# Altium project osc_evo.PrjPCB
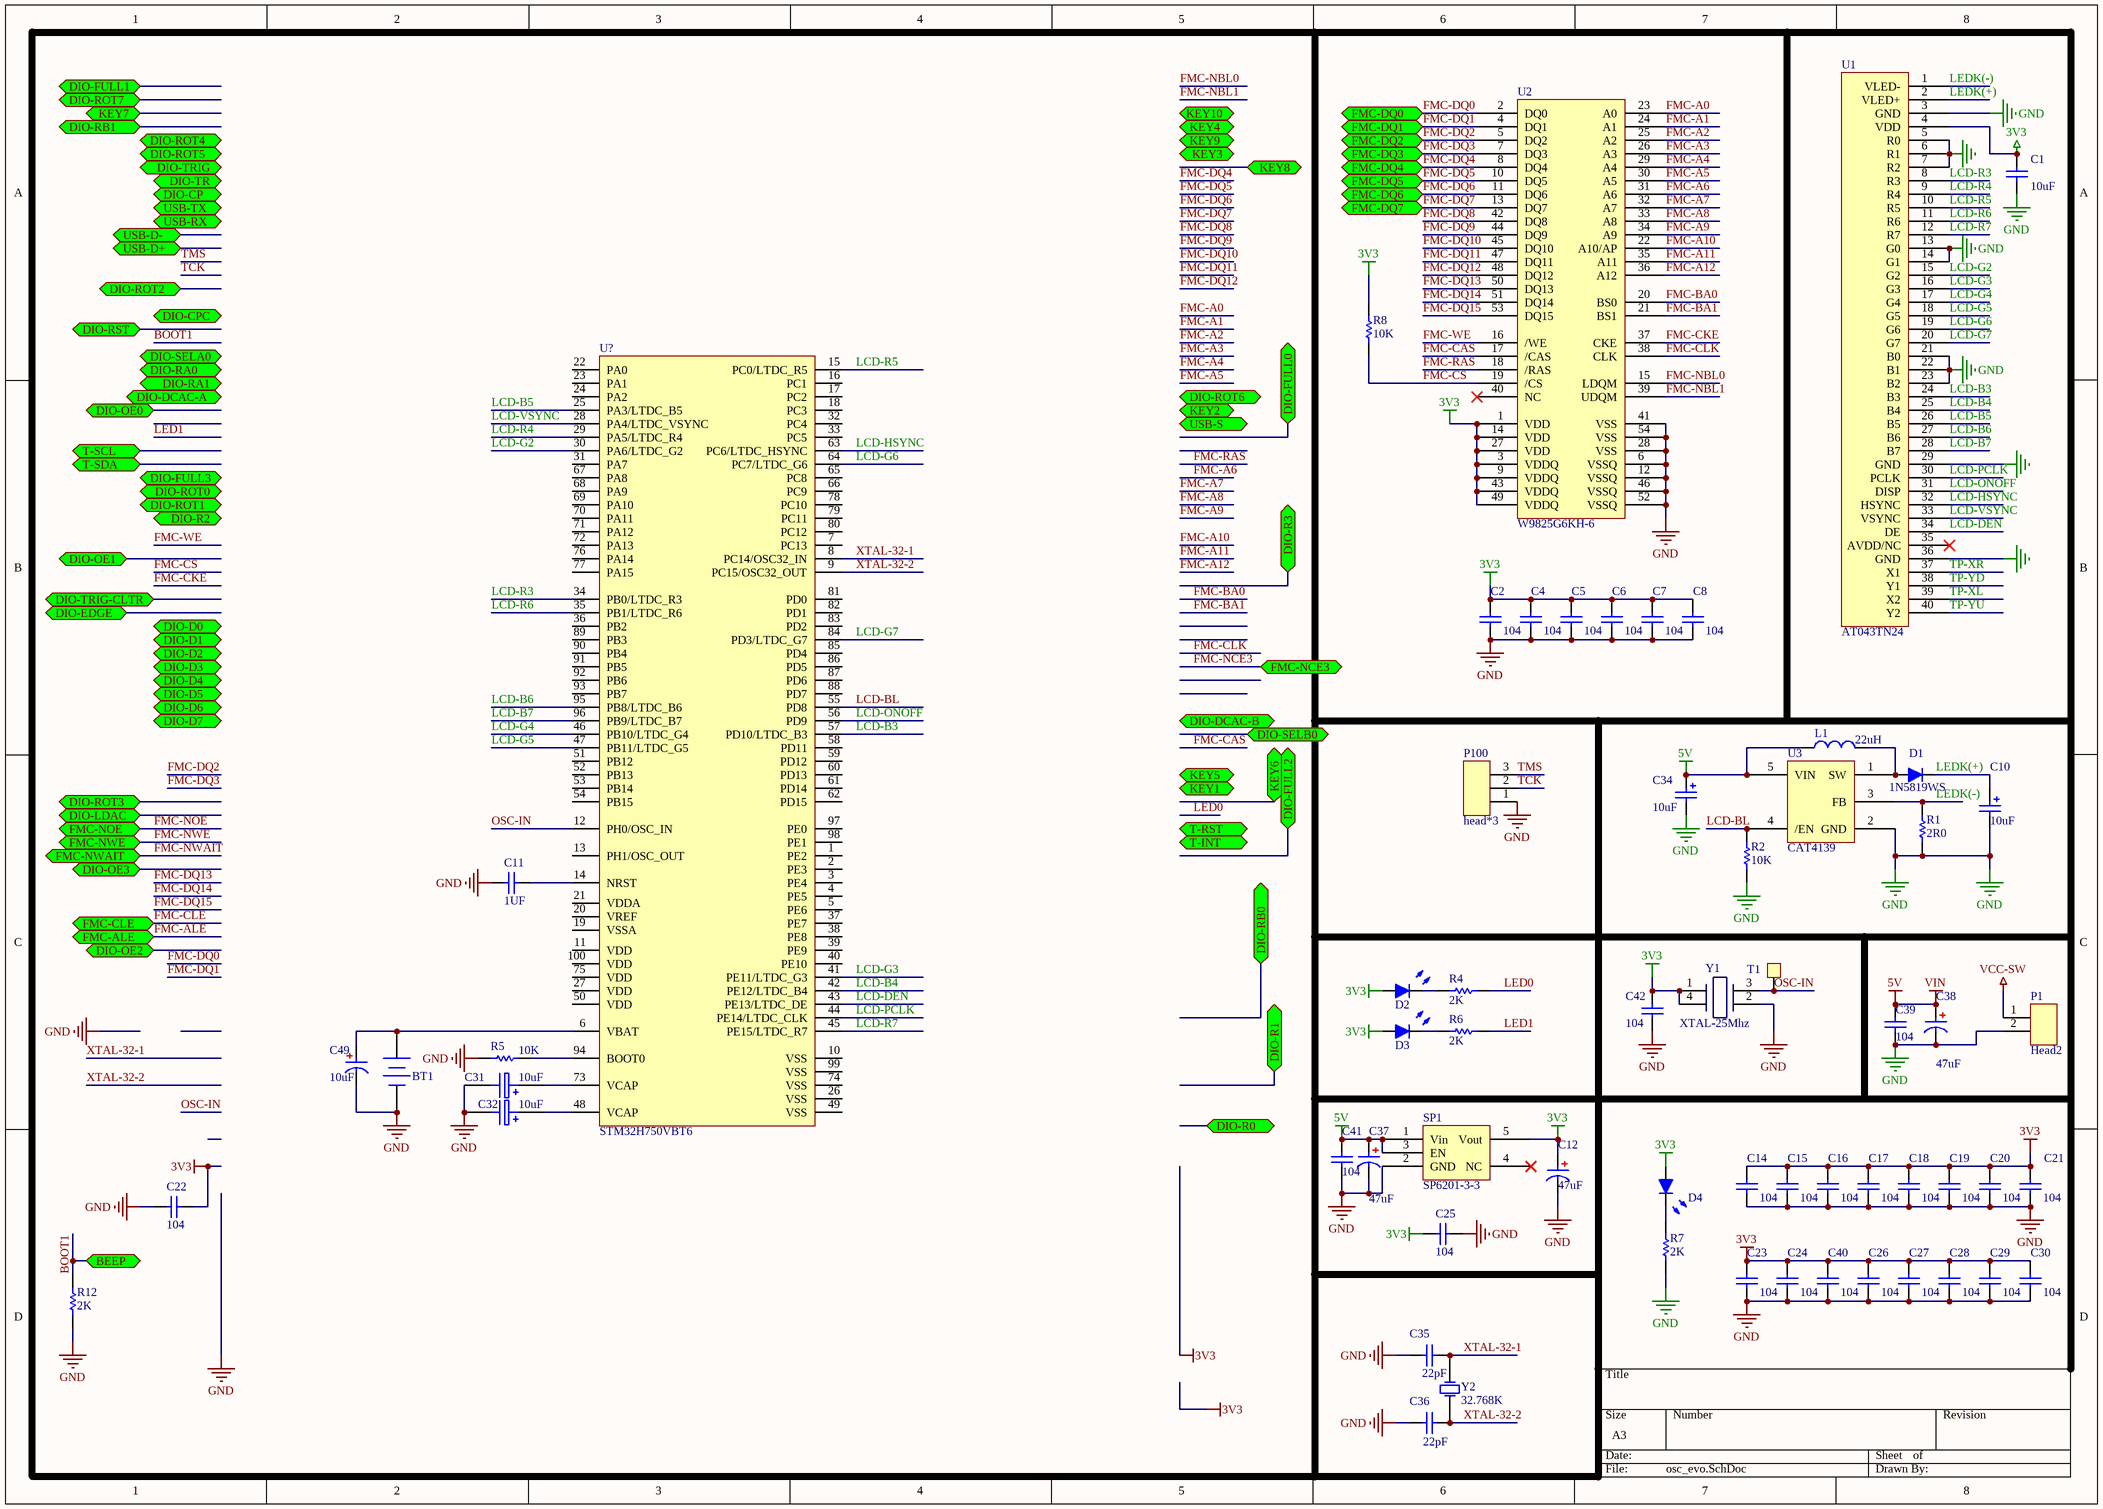
[diagram p0: osc_evo.SchDoc]
2 sheets, 114 parts. Net scope: flat (ports and power ports of the same name join across sheets).
Board file: osc_evo.PcbDoc
Sheets:
  osc_evo.SchDoc
  osc_con.SchDoc

## Sheet osc_evo.SchDoc
size A3

### Parts
BT1  Battery  [BAT1]  (value not drawn)
C1  C10uF  [0603C]  (value not drawn)
C2  C0.1uF  [0402]  (value not drawn)
C4  C0.1uF  [0402]  (value not drawn)
C5  C0.1uF  [0402]  (value not drawn)
C6  C0.1uF  [0402]  (value not drawn)
C7  C0.1uF  [0402]  (value not drawn)
C8  C0.1uF  [0402]  (value not drawn)
C10  value 10uF  [0603C]  (hidden comment: C10uF)
C11  C1UF  [0402]  (value not drawn)
C12  47uF  [CAP-T-3216]
C14  C0.1uF  [0402]  (value not drawn)
C15  C0.1uF  [0402]  (value not drawn)
C16  C0.1uF  [0402]  (value not drawn)
C17  C0.1uF  [0402]  (value not drawn)
C18  C0.1uF  [0402]  (value not drawn)
C19  C0.1uF  [0402]  (value not drawn)
C20  C0.1uF  [0402]  (value not drawn)
C21  C0.1uF  [0402]  (value not drawn)
C22  C0.1uF  [0402]  (value not drawn)
C23  C0.1uF  [0402]  (value not drawn)
C24  C0.1uF  [0402]  (value not drawn)
C25  C0.1uF  [0402]  (value not drawn)
C26  C0.1uF  [0402]  (value not drawn)
C27  C0.1uF  [0402]  (value not drawn)
C28  C0.1uF  [0402]  (value not drawn)
C29  C0.1uF  [0402]  (value not drawn)
C30  C0.1uF  [0402]  (value not drawn)
C31  10uF  [0603C]
C32  10uF  [0603C]
C34  value 10uF  [0603C]  (hidden comment: C10uF)
C35  C22pF  [0402]  (value not drawn)
C36  C22pF  [0402]  (value not drawn)
C37  47uF  [CAP-T-3216]
C38  47uF  [CAP-T-3216]
C39  C0.1uF  [0402]  (value not drawn)
C40  C0.1uF  [0402]  (value not drawn)
C41  C0.1uF  [0402]  (value not drawn)
C42  C0.1uF  [0402]  (value not drawn)
C49  C10uF  [0603C]  (value not drawn)
D1  1N5819WS  [SOD23-322F]
D2  LED-B  [LED]  (value not drawn)
D3  LED-G  [LED]  (value not drawn)
D4  LED  [LED]  (value not drawn)
L1  Inductor-22uH  [ins-443]  (value not drawn)
P1  Head2  [HEAD2]
P100  head*3  [head*3 - duplicate]
R1  R8.2  [0603R]  (value not drawn)
R2  R10K  [0402]  (value not drawn)
R4  R2K  [0402]  (value not drawn)
R5  R10K  [0402]  (value not drawn)
R6  R2K  [0402]  (value not drawn)
R7  R2K  [0402]  (value not drawn)
R8  R10K  [0402]  (value not drawn)
R12  R2K  [0402]  (value not drawn)
SP1  SP6201-3-3  [SOT23-5]
T1  TP  [TEST_POINT]  (value not drawn)
U1  AT043TN24  [FPC40-N]
U2  W9825G6KH-6  [TSOP54]
U3  CAT4139  [SOT23-5]
U?  STM32H750VBT6  [LQFP100]
Y1  XTAL-25Mhz  [XTAL3225]
Y2  Y32.768K-3216  [CRY3215-2P]  (value not drawn)

### Ports
BEEP, DIO-CP, DIO-CPC, DIO-D0, DIO-D1, DIO-D2, DIO-D3, DIO-D4, DIO-D5, DIO-D6, DIO-D7, DIO-DCAC-A, DIO-DCAC-B, DIO-EDGE, DIO-FULL0, DIO-FULL1, DIO-FULL2, DIO-FULL3, DIO-LDAC, DIO-OE0, DIO-OE1, DIO-OE2, DIO-OE3, DIO-R0, DIO-R1, DIO-R2, DIO-R3, DIO-RA0, DIO-RA1, DIO-RB0, DIO-RB1, DIO-ROT0, DIO-ROT1, DIO-ROT2, DIO-ROT3, DIO-ROT4, DIO-ROT5, DIO-ROT6, DIO-ROT7, DIO-RST, DIO-SELA0, DIO-SELB0, DIO-TR, DIO-TRIG, DIO-TRIG-CLTR, FMC-ALE, FMC-CLE, FMC-DQ0, FMC-DQ1, FMC-DQ2, FMC-DQ3, FMC-DQ4, FMC-DQ5, FMC-DQ6, FMC-DQ7, FMC-NCE3, FMC-NOE, FMC-NWAIT, FMC-NWE, KEY1, KEY2, KEY3, KEY4, KEY5, KEY6, KEY7, KEY8, KEY9, KEY10, T-INT, T-RST, T-SCL, T-SDA, USB-D+, USB-D-, USB-RX, USB-S, USB-TX

### Nets
3V3: C1.1 C2.1 C4.1 C5.1 C6.1 C7.1 C8.1 C12.1 C14.1 C15.1 C16.1 C17.1 C18.1 C19.1 C20.1 C21.1 C22.1 C23.1 C24.1 C25.1 C26.1 C27.1 C28.1 C29.1 C30.1 C40.1 C42.2 D2.1(A) D3.1(A) D4.1(A) R8.2 SP1.5(Vout) U1.4(VDD) U2.1(VDD) U2.3(VDDQ) U2.9(VDDQ) U2.14(VDD) U2.27(VDD) U2.43(VDDQ) U2.49(VDDQ) Y1.1 Y1.4
5V: C34.1 C37.1 C38.1 C39.1 C41.2 L1.1 SP1.1(Vin) SP1.3(EN) U3.5(VIN)  [also labelled VIN]
GND: BT1.2(-) C1.2 C2.2 C4.2 C5.2 C6.2 C7.2 C8.2 C10.2 C11.2 C12.2 C14.2 C15.2 C16.2 C17.2 C18.2 C19.2 C20.2 C21.2 C22.2 C23.2 C24.2 C25.2 C26.2 C27.2 C28.2 C29.2 C30.2 C31.2 C32.2 C34.2 C35.1 C36.1 C37.2 C38.2 C39.2 C40.2 C41.1 C42.1 C49.2 P1.2 P100.1 R1.2 R2.1 R5.2 R7.2 R12.1 SP1.2(GND) U1.3(GND) U1.5(R0) U1.6(R1) U1.7(R2) U1.13(G0) U1.14(G1) U1.21(B0) U1.22(B1) U1.23(B2) U1.29(GND) U1.36(GND) U2.6(VSSQ) U2.12(VSSQ) U2.28(VSS) U2.41(VSS) U2.46(VSSQ) U2.52(VSSQ) U2.54(VSS) U3.2(GND) Y1.2
VCC-SW: P1.1
BOOT1: R12.2 ; port BEEP
FMC-A0: U2.23(A0)
FMC-A1: U2.24(A1)
FMC-A2: U2.25(A2)
FMC-A3: U2.26(A3)
FMC-A4: U2.29(A4)
FMC-A5: U2.30(A5)
FMC-A6: U2.31(A6)
FMC-A7: U2.32(A7)
FMC-A8: U2.33(A8)
FMC-A9: U2.34(A9)
FMC-A10: U2.22(A10/AP)
FMC-A11: U2.35(A11)
FMC-A12: U2.36(A12)
FMC-BA0: U2.20(BS0)
FMC-BA1: U2.21(BS1)
FMC-CAS: U2.17(/CAS)
FMC-CKE: U2.37(CKE)
FMC-CLK: U2.38(CLK)
FMC-CS: R8.1 U2.19(/CS)
FMC-DQ0: U2.2(DQ0) ; port FMC-DQ0
FMC-DQ1: U2.4(DQ1) ; port FMC-DQ1
FMC-DQ2: U2.5(DQ2) ; port FMC-DQ2
FMC-DQ3: U2.7(DQ3) ; port FMC-DQ3
FMC-DQ4: U2.8(DQ4) ; port FMC-DQ4
FMC-DQ5: U2.10(DQ5) ; port FMC-DQ5
FMC-DQ6: U2.11(DQ6) ; port FMC-DQ6
FMC-DQ7: U2.13(DQ7) ; port FMC-DQ7
FMC-DQ8: U2.42(DQ8)
FMC-DQ9: U2.44(DQ9)
FMC-DQ10: U2.45(DQ10)
FMC-DQ11: U2.47(DQ11)
FMC-DQ12: U2.48(DQ12)
FMC-DQ13: U2.50(DQ13)
FMC-DQ14: U2.51(DQ14)
FMC-DQ15: U2.53(DQ15)
FMC-NBL0: U2.15(LDQM)
FMC-NBL1: U2.39(UDQM)
FMC-RAS: U2.18(/RAS)
FMC-WE: U2.16(/WE)
LCD-B3: U1.24(B3) U?.57(PD10/LTDC_B3)
LCD-B4: U1.25(B4) U?.42(PE12/LTDC_B4)
LCD-B5: U1.26(B5) U?.25(PA3/LTDC_B5)
LCD-B6: U1.27(B6) U?.95(PB8/LTDC_B6)
LCD-B7: U1.28(B7) U?.96(PB9/LTDC_B7)
LCD-BL: R2.2 U3.4(/EN) U?.55(PD8)
LCD-DEN: U1.34(DE) U?.43(PE13/LTDC_DE)
LCD-G2: U1.15(G2) U?.30(PA6/LTDC_G2)
LCD-G3: U1.16(G3) U?.41(PE11/LTDC_G3)
LCD-G4: U1.17(G4) U?.46(PB10/LTDC_G4)
LCD-G5: U1.18(G5) U?.47(PB11/LTDC_G5)
LCD-G6: U1.19(G6) U?.64(PC7/LTDC_G6)
LCD-G7: U1.20(G7) U?.84(PD3/LTDC_G7)
LCD-HSYNC: U1.32(HSYNC) U?.63(PC6/LTDC_HSYNC)
LCD-ONOFF: U1.31(DISP) U?.56(PD9)
LCD-PCLK: U1.30(PCLK) U?.44(PE14/LTDC_CLK)
LCD-R3: U1.8(R3) U?.34(PB0/LTDC_R3)
LCD-R4: U1.9(R4) U?.29(PA5/LTDC_R4)
LCD-R5: U1.10(R5) U?.15(PC0/LTDC_R5)
LCD-R6: U1.11(R6) U?.35(PB1/LTDC_R6)
LCD-R7: U1.12(R7) U?.45(PE15/LTDC_R7)
LCD-VSYNC: U1.33(VSYNC) U?.28(PA4/LTDC_VSYNC)
LED0: R4.2
LED1: R6.2
LEDK(+): C10.1 D1.2(K) U1.2(VLED+)
LEDK(-): R1.1 U1.1(VLED-) U3.3(FB)
OSC-IN: T1.1(R) U?.12(PH0/OSC_IN) Y1.3
TCK: P100.2
TMS: P100.3
TP-XL: U1.39(X2)
TP-XR: U1.37(X1)
TP-YD: U1.38(Y1)
TP-YU: U1.40(Y2)
XTAL-32-1: C35.2 U?.8(PC14/OSC32_IN) Y2.2(OSC2)
XTAL-32-2: C36.2 U?.9(PC15/OSC32_OUT) Y2.1(OSC1)
NetBT1_1: BT1.1(+) C49.1 U?.6(VBAT)
NetC11_1: C11.1 U?.14(NRST)
NetC31_1: C31.1 U?.73(VCAP)
NetC32_1: C32.1 U?.48(VCAP)
NetD1_1: D1.1(A) L1.2 U3.1(SW)
NetD2_2: D2.2(K) R4.1
NetD3_2: D3.2(K) R6.1
NetD4_2: D4.2(K) R7.1
NetR5_1: R5.1 U?.94(BOOT0)

Not connected (* = marked no-connect by the designer): SP1 4(NC)*; U1 35(AVDD/NC)*; U2 40(NC)*; U? 1(PE2) 2(PE3) 3(PE4) 4(PE5) 5(PE6) 7(PC13) 10(VSS) 11(VDD) 13(PH1/OSC_OUT) 16(PC1) 17(PC2) 18(PC3) 19(VSSA) 20(VREF) 21(VDDA) 22(PA0) 23(PA1) 24(PA2) 26(VSS) 27(VDD) 31(PA7) 32(PC4) 33(PC5) 36(PB2) 37(PE7) 38(PE8) 39(PE9) 40(PE10) 49(VSS) 50(VDD) 51(PB12) 52(PB13) 53(PB14) 54(PB15) 58(PD11) 59(PD12) 60(PD13) 61(PD14) 62(PD15) 65(PC8) 66(PC9) 67(PA8) 68(PA9) 69(PA10) 70(PA11) 71(PA12) 72(PA13) 74(VSS) 75(VDD) 76(PA14) 77(PA15) 78(PC10) 79(PC11) 80(PC12) 81(PD0) 82(PD1) 83(PD2) 85(PD4) 86(PD5) 87(PD6) 88(PD7) 89(PB3) 90(PB4) 91(PB5) 92(PB6) 93(PB7) 97(PE0) 98(PE1) 99(VSS) 100(VDD)

### Notes on the sheet
- (in symbol C0.1uF) 1UF; 104
- (in symbol C10uF) 10uF
- (in symbol C10uF-B) 10uF
- (in symbol C22pF) 22pF
- (in symbol Inductor-100uH) 22uH
- (in symbol R2K) 2K
- (in symbol R8.2) 2R0
- (in symbol R10K) 10K
- (in symbol Y32.768K) 32.768K

### Library data of the parts
BT1 = Battery: Multicell Battery; Published: 24-Mar-1999; Revision: July-2002: Re-released for DXP Platform.; Publisher: Altium Limited
C1 = C10uF-B
C10 C34 = Cap Pol1: Polarized Capacitor (Radial); Published: 8-Jun-2000; Revision: July-2002: Re-released for DXP Platform.; Publisher: Altium Limited
C11 = C0.1uF
C12 C37 C38 = C10uF: 贴片电容
C31 C32 = ELECTRO1: Electrolytic Capacitor
D1 = Diode
D2 D3 = LED
L1 = Inductor-100uH
SP1 = SP6201
Y1 = XTAL-100Mhz
Y2 = Y32.768K

## Sheet osc_con.SchDoc
size A4
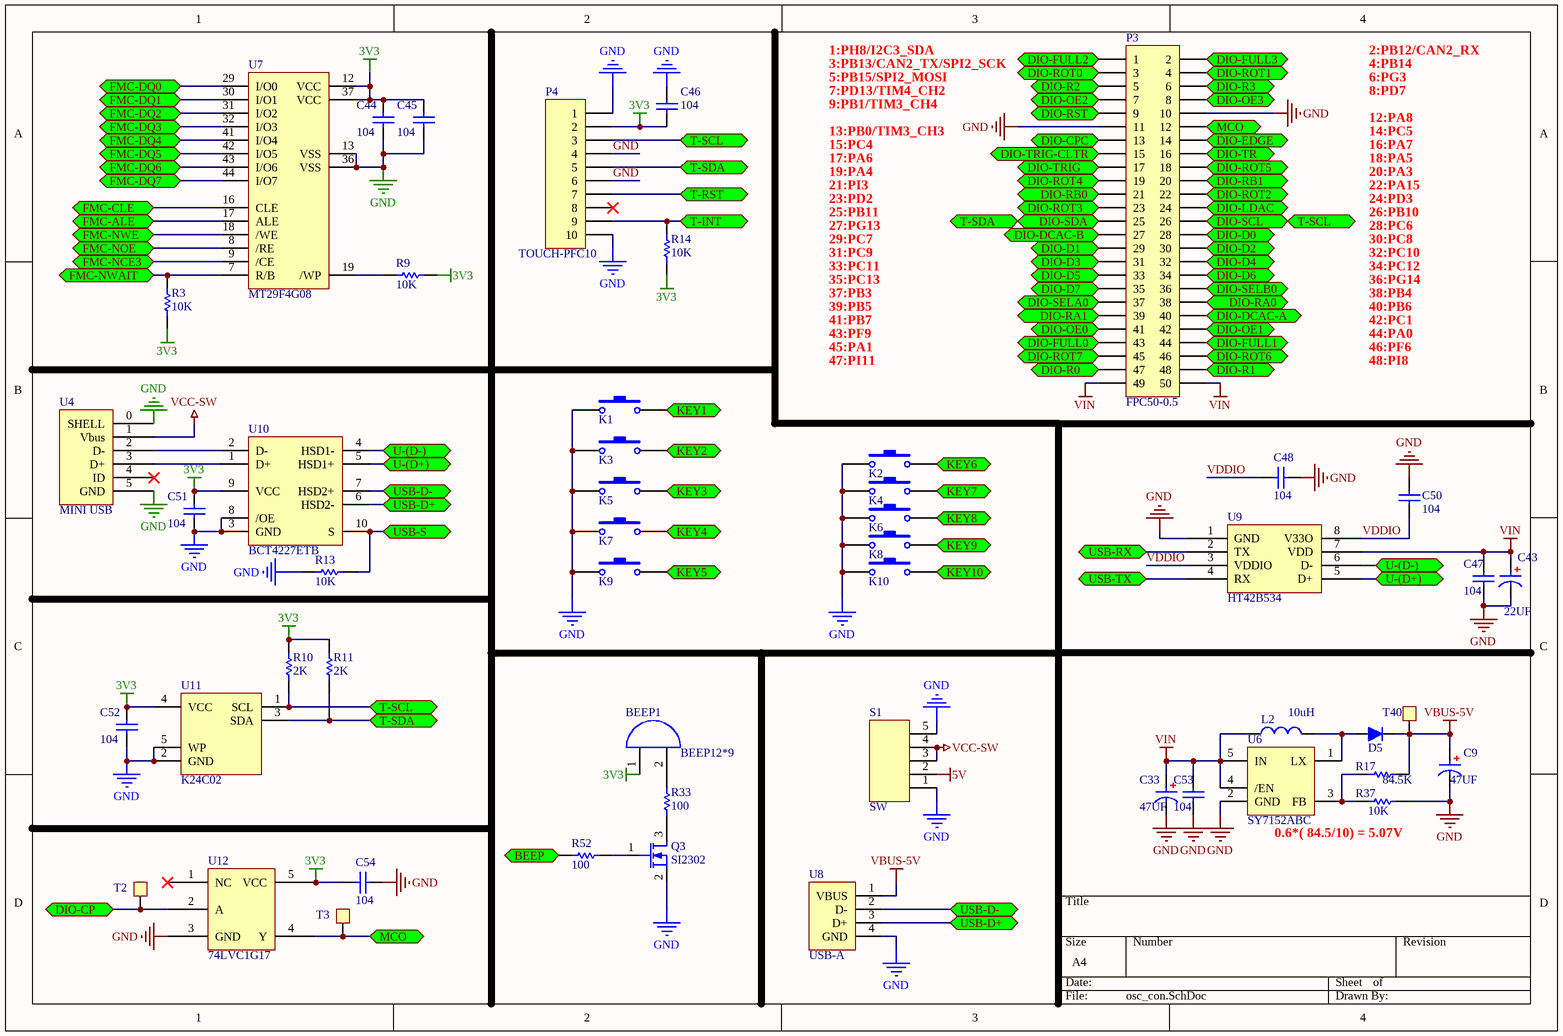
[diagram p1: osc_con.SchDoc]

### Parts
BEEP1  BEEP12*9  [BEEP]
C9  47UF  [CAP-T-3216]
C33  47UF  [CAP-T-3216]
C43  22UF  [0603C]
C44  C0.1uF  [0402]  (value not drawn)
C45  C0.1uF  [0402]  (value not drawn)
C46  C0.1uF  [0402]  (value not drawn)
C47  104  [0402]
C48  104  [0402]
C50  104  [0402]
C51  C0.1uF  [0402]  (value not drawn)
C52  C0.1uF  [0402]  (value not drawn)
C53  104  [0402]
C54  C0.1uF  [0402]  (value not drawn)
D5  1N5918WS  [SOD23-322F]  (value not drawn)
K1  KEY-PB  [KEY_6*6*4.3]  (value not drawn)
K2  KEY-PB  [KEY_6*6*4.3]  (value not drawn)
K3  KEY-PB  [KEY_6*6*4.3]  (value not drawn)
K4  KEY-PB  [KEY_6*6*4.3]  (value not drawn)
K5  KEY-PB  [KEY_6*6*4.3]  (value not drawn)
K6  KEY-PB  [KEY_6*6*4.3]  (value not drawn)
K7  KEY-PB  [KEY_6*6*4.3]  (value not drawn)
K8  KEY-PB  [KEY_6*6*4.3]  (value not drawn)
K9  KEY-PB  [KEY_6*6*4.3]  (value not drawn)
K10  KEY-PB  [KEY_6*6*4.3]  (value not drawn)
L2  10uH  [0805]
P3  FPC50-0.5  [FPC50-0.5]
P4  TOUCH-PFC10  [FPC10-0.5]
Q3  SI2302  [SOT-23-3]
R3  R10K  [0402]  (value not drawn)
R9  R10K  [0402]  (value not drawn)
R10  R2K  [0402]  (value not drawn)
R11  R2K  [0402]  (value not drawn)
R13  R10K  [0402]  (value not drawn)
R14  R10K  [0402]  (value not drawn)
R17  R84.5K  [0402]  (value not drawn)
R33  R100R  [0402]  (value not drawn)
R37  10K  [0402]
R52  R100R  [0402]  (value not drawn)
S1  SW  [SW-3]
T2  TP  [TEST_POINT]  (value not drawn)
T3  TP  [TEST_POINT]  (value not drawn)
T40  TP  [TEST_POINT]  (value not drawn)
U4  MINI USB  [Micro_USB_t]
U6  SY7152ABC  [SOT23-6]
U7  MT29F4G08  [TSOP48]
U8  USB-A  [USB-A-SMA]
U9  HT42B534  [SOP-8]
U10  BCT4227ETB  [WQFN10]
U11  K24C02  [SOT23-5]
U12  74LVC1G17  [SOT23-5]

### Ports
BEEP, DIO-CP, DIO-CPC, DIO-D0, DIO-D1, DIO-D2, DIO-D3, DIO-D4, DIO-D5, DIO-D6, DIO-D7, DIO-DCAC-A, DIO-DCAC-B, DIO-EDGE, DIO-FULL0, DIO-FULL1, DIO-FULL2, DIO-FULL3, DIO-LDAC, DIO-OE0, DIO-OE1, DIO-OE2, DIO-OE3, DIO-R0, DIO-R1, DIO-R2, DIO-R3, DIO-RA0, DIO-RA1, DIO-RB0, DIO-RB1, DIO-ROT0, DIO-ROT1, DIO-ROT2, DIO-ROT3, DIO-ROT4, DIO-ROT5, DIO-ROT6, DIO-ROT7, DIO-RST, DIO-SCL, DIO-SDA, DIO-SELA0, DIO-SELB0, DIO-TR, DIO-TRIG, DIO-TRIG-CLTR, FMC-ALE, FMC-CLE, FMC-DQ0, FMC-DQ1, FMC-DQ2, FMC-DQ3, FMC-DQ4, FMC-DQ5, FMC-DQ6, FMC-DQ7, FMC-NCE3, FMC-NOE, FMC-NWAIT, FMC-NWE, KEY1, KEY2, KEY3, KEY4, KEY5, KEY6, KEY7, KEY8, KEY9, KEY10, MCO, T-INT, T-RST, T-SCL, T-SDA, U-(D+), U-(D-), USB-D+, USB-D-, USB-RX, USB-S, USB-TX

### Nets
3V3: BEEP1.1(A) C44.1 C45.1 C46.2 C51.1 C52.1 C54.1 P4.2 R3.1 R9.2 R10.2 R11.2 R14.1 U7.12(VCC) U7.37(VCC) U10.9(VCC) U11.4(VCC) U12.5(VCC)
5V: C33.1 C43.1 C47.1 C53.1 L2.1 P3.49 P3.50 S1.2 U6.4(/EN) U6.5(IN) U9.7(VDD)  [also labelled VIN]
GND: C9.2 C33.2 C43.2 C44.2 C45.2 C46.1 C47.2 C48.2 C50.2 C51.2 C52.2 C53.2 C54.2 K1.1 K2.1 K3.1 K4.1 K5.1 K6.1 K7.1 K8.1 K9.1 K10.1 P3.10 P3.11 P4.1 P4.4 P4.6 P4.10 Q3.2(S) R13.1 R37.1 S1.1 S1.5 U4.0(SHELL) U4.5(GND) U6.2(GND) U7.13(VSS) U7.36(VSS) U8.4(GND) U9.1(GND) U10.3(GND) U10.8(/OE) U11.2(GND) U11.5(WP) U12.3(GND)
VBUS-5V: C9.1 D5.2(K) R17.2 T40.1(R) U8.1(VBUS)
VCC-SW: S1.3 S1.4 U4.1(Vbus)
BOOT1: R52.1 ; port BEEP
FMC-ALE: U7.17(ALE) ; port FMC-ALE
FMC-CLE: U7.16(CLE) ; port FMC-CLE
FMC-DQ0: U7.29(I/O0) ; port FMC-DQ0
FMC-DQ1: U7.30(I/O1) ; port FMC-DQ1
FMC-DQ2: U7.31(I/O2) ; port FMC-DQ2
FMC-DQ3: U7.32(I/O3) ; port FMC-DQ3
FMC-DQ4: U7.41(I/O4) ; port FMC-DQ4
FMC-DQ5: U7.42(I/O5) ; port FMC-DQ5
FMC-DQ6: U7.43(I/O6) ; port FMC-DQ6
FMC-DQ7: U7.44(I/O7) ; port FMC-DQ7
FMC-NCE3: U7.9(/CE) ; port FMC-NCE3
FMC-NOE: U7.8(/RE) ; port FMC-NOE
FMC-NWAIT: R3.2 U7.7(R/B) ; port FMC-NWAIT
FMC-NWE: U7.18(/WE) ; port FMC-NWE
VDDIO: C48.1 C50.1 U9.3(VDDIO) U9.8(V33O)
NetBEEP1_2: BEEP1.2(B) R33.2
NetD5_1: D5.1(A) L2.2 U6.1(LX)
NetK1_2: K1.2 ; port KEY1
NetK2_2: K2.2 ; port KEY6
NetK3_2: K3.2 ; port KEY2
NetK4_2: K4.2 ; port KEY7
NetK5_2: K5.2 ; port KEY3
NetK6_2: K6.2 ; port KEY8
NetK7_2: K7.2 ; port KEY4
NetK8_2: K8.2 ; port KEY9
NetK9_2: K9.2 ; port KEY5
NetK10_2: K10.2 ; port KEY10
NetP3_1: P3.1 ; port DIO-FULL2
NetP3_2: P3.2 ; port DIO-FULL3
NetP3_3: P3.3 ; port DIO-ROT0
NetP3_4: P3.4 ; port DIO-ROT1
NetP3_5: P3.5 ; port DIO-R2
NetP3_6: P3.6 ; port DIO-R3
NetP3_7: P3.7 ; port DIO-OE2
NetP3_8: P3.8 ; port DIO-OE3
NetP3_9: P3.9 ; port DIO-RST
NetP3_12: P3.12 T3.1(R) U12.4(Y) ; port MCO
NetP3_13: P3.13 ; port DIO-CPC
NetP3_14: P3.14 ; port DIO-EDGE
NetP3_15: P3.15 ; port DIO-TRIG-CLTR
NetP3_16: P3.16 ; port DIO-TR
NetP3_17: P3.17 ; port DIO-TRIG
NetP3_18: P3.18 ; port DIO-ROT5
NetP3_19: P3.19 ; port DIO-ROT4
NetP3_20: P3.20 ; port DIO-RB1
NetP3_21: P3.21 ; port DIO-RB0
NetP3_22: P3.22 ; port DIO-ROT2
NetP3_23: P3.23 ; port DIO-ROT3
NetP3_24: P3.24 ; port DIO-LDAC
NetP3_25: P3.25 P4.5 R11.1 U11.3(SDA) ; port DIO-SDA, port T-SDA
NetP3_26: P3.26 P4.3 R10.1 U11.1(SCL) ; port DIO-SCL, port T-SCL
NetP3_27: P3.27 ; port DIO-DCAC-B
NetP3_28: P3.28 ; port DIO-D0
NetP3_29: P3.29 ; port DIO-D1
NetP3_30: P3.30 ; port DIO-D2
NetP3_31: P3.31 ; port DIO-D3
NetP3_32: P3.32 ; port DIO-D4
NetP3_33: P3.33 ; port DIO-D5
NetP3_34: P3.34 ; port DIO-D6
NetP3_35: P3.35 ; port DIO-D7
NetP3_36: P3.36 ; port DIO-SELB0
NetP3_37: P3.37 ; port DIO-SELA0
NetP3_38: P3.38 ; port DIO-RA0
NetP3_39: P3.39 ; port DIO-RA1
NetP3_40: P3.40 ; port DIO-DCAC-A
NetP3_41: P3.41 ; port DIO-OE0
NetP3_42: P3.42 ; port DIO-OE1
NetP3_43: P3.43 ; port DIO-FULL0
NetP3_44: P3.44 ; port DIO-FULL1
NetP3_45: P3.45 ; port DIO-ROT7
NetP3_46: P3.46 ; port DIO-ROT6
NetP3_47: P3.47 ; port DIO-R0
NetP3_48: P3.48 ; port DIO-R1
NetP4_7: P4.7 ; port T-RST
NetP4_9: P4.9 R14.2 ; port T-INT
NetQ3_1: Q3.1(G) R52.2
NetQ3_3: Q3.3(D) R33.1
NetR9_1: R9.1 U7.19(/WP)
NetR13_2: R13.2 U10.10(S) ; port USB-S
NetR17_1: R17.1 R37.2 U6.3(FB)
NetT2_1: T2.1(R) U12.2(A) ; port DIO-CP
NetU4_2: U4.2(D-) U10.2(D-)
NetU4_3: U4.3(D+) U10.1(D+)
NetU8_2: U8.2(D-) U10.7(HSD2+) ; port USB-D-
NetU8_3: U8.3(D+) U10.6(HSD2-) ; port USB-D+
NetU9_2: U9.2(TX) ; port USB-RX
NetU9_4: U9.4(RX) ; port USB-TX
NetU9_5: U9.5(D+) U10.5(HSD1+) ; port U-(D+)
NetU9_6: U9.6(D-) U10.4(HSD1-) ; port U-(D-)

Not connected (* = marked no-connect by the designer): P4 8*; U4 4(ID)*; U6 6; U12 1(NC)*

### Notes on the sheet
- 1:PH8/I2C3_SDA
- 3:PB13/CAN2_TX/SPI2_SCK
- 5:PB15/SPI2_MOSI
- 7:PD13/TIM4_CH2
- 9:PB1/TIM3_CH4
- 2:PB12/CAN2_RX
- 4:PB14
- 6:PG3
- 8:PD7
- 13:PB0/TIM3_CH3
- 15:PC4
- 17:PA6
- 19:PA4
- 12:PA8
- 14:PC5
- 16:PA7
- 18:PA5
- 20:PA3
- 21:PI3
- 23:PD2
- 25:PB11
- 27:PG13
- 29:PC7
- 22:PA15
- 24:PD3
- 26:PB10
- 28:PC6
- 30:PC8
- 31:PC9
- 33:PC11
- 35:PC13
- 37:PB3
- 39:PB5
- 32:PC10
- 34:PC12
- 36:PG14
- 38:PB4
- 40:PB6
- 41:PB7
- 43:PF9
- 45:PA1
- 47:PI11
- 42:PC1
- 44:PA0
- 46:PF6
- 48:PI8
- 0.6*( 84.5/10) = 5.07V
- (in symbol C0.1uF) 104
- (in symbol R1M) 84.5K
- (in symbol R2K) 10K; 2K
- (in symbol R100R) 100

### Library data of the parts
BEEP1 = Bell: Electrical Bell; Published: 24-Mar-1999; LatestRevisionDate: 17-Jul-2002; LatestRevisionNote: Re-released for DXP Platform.; PackageReference: PIN2; Publisher: Altium Limited
C9 C33 = C10uF: 贴片电容
C43 = C100uF
C47 C48 C50 C53 = C0.1uF
D5 = Diode
L2 = Inductor-100uH
P3 = Header 25X2: Header, 25-Pin, Dual row; LatestRevisionDate: 17-Jul-2002; LatestRevisionNote: Re-released for DXP Platform.; Publisher: Altium Limited
P4 = Header 10: Header, 10-Pin; LatestRevisionDate: 17-Jul-2002; LatestRevisionNote: Re-released for DXP Platform.; Publisher: Altium Limited
Q3 = MOSFET-N
R3 R9 R13 R14 = R2K
R17 R37 = R1M
S1 = HEAD5

## Nets that join several sheets
3V3: osc_evo (42 pins), osc_con (18 pins)
5V: osc_evo (9 pins), osc_con (11 pins)
GND: osc_evo (68 pins), osc_con (46 pins)
VCC-SW: osc_evo (P1.1), osc_con (S1.3 S1.4 U4.1)
BOOT1: osc_evo (R12.2), osc_con (R52.1)
FMC-DQ0: osc_evo (U2.2), osc_con (U7.29)
FMC-DQ1: osc_evo (U2.4), osc_con (U7.30)
FMC-DQ2: osc_evo (U2.5), osc_con (U7.31)
FMC-DQ3: osc_evo (U2.7), osc_con (U7.32)
FMC-DQ4: osc_evo (U2.8), osc_con (U7.41)
FMC-DQ5: osc_evo (U2.10), osc_con (U7.42)
FMC-DQ6: osc_evo (U2.11), osc_con (U7.43)
FMC-DQ7: osc_evo (U2.13), osc_con (U7.44)